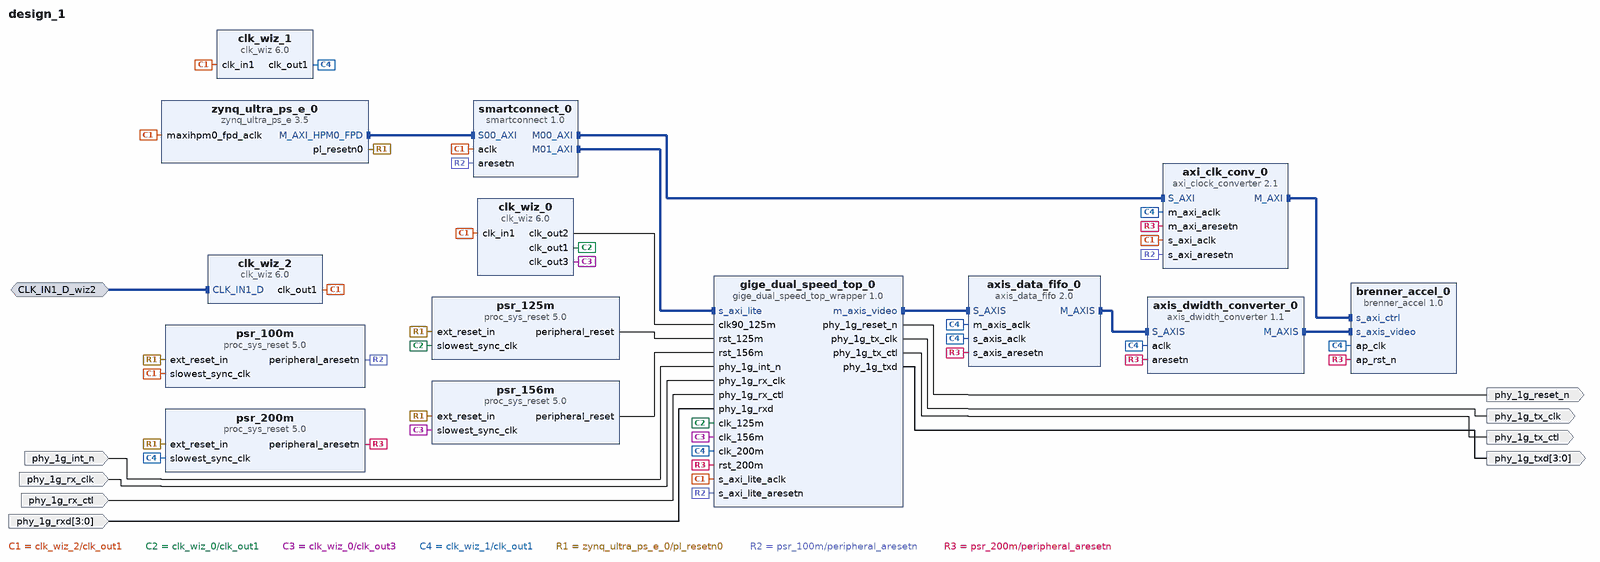
[diagram p0: block diagram of the top level]
# Vivado block design design_1, xczu3eg-sfvc784-1-i, Vivado 2024.2.2
create_bd_design design_1

create_bd_intf_port -mode Slave -vlnv xilinx.com:interface:diff_clock_rtl:1.0 CLK_IN1_D_wiz2
set_property -dict {CONFIG.FREQ_HZ 100000000} [get_bd_intf_ports CLK_IN1_D_wiz2]
create_bd_port -dir I phy_1g_rx_clk
create_bd_port -dir I -from 3 -to 0 phy_1g_rxd
create_bd_port -dir I phy_1g_rx_ctl
create_bd_port -dir O phy_1g_tx_clk
create_bd_port -dir O -from 3 -to 0 phy_1g_txd
create_bd_port -dir O phy_1g_tx_ctl
create_bd_port -dir O phy_1g_reset_n
create_bd_port -dir I phy_1g_int_n

create_bd_cell -type ip -vlnv xilinx.com:ip:zynq_ultra_ps_e:3.5 zynq_ultra_ps_e_0
set_property -dict [list \
  CONFIG.PSU__CRF_APB__DDR_CTRL__FREQMHZ 800 \
  CONFIG.PSU__DDRC__BUS_WIDTH {64 Bit} \
  CONFIG.PSU__DDRC__COMPONENTS Components \
  CONFIG.PSU__DDRC__DEVICE_CAPACITY {2048 MBits} \
  CONFIG.PSU__DDRC__DRAM_WIDTH {8 Bits} \
  CONFIG.PSU__DDRC__ECC Disabled \
  CONFIG.PSU__DDRC__MEMORY_TYPE {DDR 4} \
  CONFIG.PSU__DDRC__SPEED_BIN DDR4_1600J \
  CONFIG.PSU__DDR_HIGH_ADDRESS_GUI_ENABLE 0 \
  CONFIG.PSU__DDR__INTERFACE__FREQMHZ 400.000 \
  CONFIG.PSU__DEVICE_TYPE EG \
  CONFIG.PSU__FPGA_PL0_ENABLE 1 \
  CONFIG.PSU__MAXIGP0__DATA_WIDTH 128 \
  CONFIG.PSU__PSS_REF_CLK__FREQMHZ 33.333 \
  CONFIG.PSU__USE__IRQ0 0 \
  CONFIG.PSU__USE__M_AXI_GP0 1 \
  CONFIG.PSU__USE__M_AXI_GP1 0 \
  CONFIG.PSU__USE__M_AXI_GP2 0 \
] [get_bd_cells zynq_ultra_ps_e_0]
# 77 more settings of zynq_ultra_ps_e_0 are not shown: defaults, MIO pin electricals, DDR timing, and values the tool derives
create_bd_cell -type ip -vlnv xilinx.com:ip:clk_wiz:6.0 clk_wiz_0
set_property -dict [list \
  CONFIG.CLKOUT1_REQUESTED_DUTY_CYCLE 50.000 \
  CONFIG.CLKOUT1_REQUESTED_OUT_FREQ 125 \
  CONFIG.CLKOUT1_REQUESTED_PHASE 0.000 \
  CONFIG.CLKOUT1_USED true \
  CONFIG.CLKOUT2_REQUESTED_DUTY_CYCLE 50.000 \
  CONFIG.CLKOUT2_REQUESTED_OUT_FREQ 125 \
  CONFIG.CLKOUT2_REQUESTED_PHASE 90.000 \
  CONFIG.CLKOUT2_USED true \
  CONFIG.CLKOUT3_REQUESTED_DUTY_CYCLE 50.000 \
  CONFIG.CLKOUT3_REQUESTED_OUT_FREQ 156.25 \
  CONFIG.CLKOUT3_REQUESTED_PHASE 0.000 \
  CONFIG.CLKOUT3_USED true \
  CONFIG.CLKOUT4_USED false \
  CONFIG.CLKOUT5_USED false \
  CONFIG.CLKOUT6_USED false \
  CONFIG.CLKOUT7_USED false \
  CONFIG.MMCM_CLKFBOUT_MULT_F 12.500 \
  CONFIG.MMCM_CLKIN1_PERIOD 10.000 \
  CONFIG.MMCM_CLKOUT0_DIVIDE_F 10.000 \
  CONFIG.MMCM_CLKOUT0_DUTY_CYCLE 0.500 \
  CONFIG.MMCM_CLKOUT0_PHASE 0.000 \
  CONFIG.MMCM_CLKOUT1_DIVIDE 10 \
  CONFIG.MMCM_CLKOUT1_DUTY_CYCLE 0.500 \
  CONFIG.MMCM_CLKOUT1_PHASE 90.000 \
  CONFIG.MMCM_CLKOUT2_DIVIDE 8 \
  CONFIG.MMCM_CLKOUT2_DUTY_CYCLE 0.500 \
  CONFIG.MMCM_CLKOUT2_PHASE 0.000 \
  CONFIG.MMCM_COMPENSATION AUTO \
  CONFIG.MMCM_DIVCLK_DIVIDE 1 \
  CONFIG.NUM_OUT_CLKS 3 \
  CONFIG.PHASESHIFT_MODE WAVEFORM \
  CONFIG.PRIMITIVE MMCM \
  CONFIG.PRIM_IN_FREQ 100 \
  CONFIG.PRIM_SOURCE Single_ended_clock_capable_pin \
  CONFIG.RESET_TYPE ACTIVE_HIGH \
  CONFIG.USE_LOCKED true \
  CONFIG.USE_PHASE_ALIGNMENT true \
  CONFIG.USE_RESET false \
] [get_bd_cells clk_wiz_0]
create_bd_cell -type ip -vlnv xilinx.com:ip:clk_wiz:6.0 clk_wiz_1
set_property -dict [list \
  CONFIG.CLKOUT1_REQUESTED_DUTY_CYCLE 50.000 \
  CONFIG.CLKOUT1_REQUESTED_OUT_FREQ 200 \
  CONFIG.CLKOUT1_REQUESTED_PHASE 0.000 \
  CONFIG.CLKOUT1_USED true \
  CONFIG.CLKOUT2_USED false \
  CONFIG.CLKOUT3_USED false \
  CONFIG.CLKOUT4_USED false \
  CONFIG.CLKOUT5_USED false \
  CONFIG.CLKOUT6_USED false \
  CONFIG.CLKOUT7_USED false \
  CONFIG.MMCM_CLKFBOUT_MULT_F 12.000 \
  CONFIG.MMCM_CLKIN1_PERIOD 10.000 \
  CONFIG.MMCM_CLKOUT0_DIVIDE_F 6.000 \
  CONFIG.MMCM_CLKOUT0_DUTY_CYCLE 0.500 \
  CONFIG.MMCM_CLKOUT0_PHASE 0.000 \
  CONFIG.MMCM_COMPENSATION AUTO \
  CONFIG.MMCM_DIVCLK_DIVIDE 1 \
  CONFIG.NUM_OUT_CLKS 1 \
  CONFIG.PRIMITIVE MMCM \
  CONFIG.PRIM_IN_FREQ 100 \
  CONFIG.PRIM_SOURCE Single_ended_clock_capable_pin \
  CONFIG.RESET_TYPE ACTIVE_HIGH \
  CONFIG.USE_LOCKED true \
  CONFIG.USE_PHASE_ALIGNMENT false \
  CONFIG.USE_RESET false \
] [get_bd_cells clk_wiz_1]
create_bd_cell -type ip -vlnv xilinx.com:ip:clk_wiz:6.0 clk_wiz_2
set_property -dict [list \
  CONFIG.CLKOUT1_REQUESTED_DUTY_CYCLE 50.000 \
  CONFIG.CLKOUT1_REQUESTED_OUT_FREQ 100 \
  CONFIG.CLKOUT1_REQUESTED_PHASE 0.000 \
  CONFIG.CLKOUT1_USED true \
  CONFIG.CLKOUT2_USED false \
  CONFIG.CLKOUT3_USED false \
  CONFIG.CLKOUT4_USED false \
  CONFIG.CLKOUT5_USED false \
  CONFIG.CLKOUT6_USED false \
  CONFIG.CLKOUT7_USED false \
  CONFIG.MMCM_CLKFBOUT_MULT_F 12.000 \
  CONFIG.MMCM_CLKIN1_PERIOD 10.000 \
  CONFIG.MMCM_CLKOUT0_DIVIDE_F 12.000 \
  CONFIG.MMCM_CLKOUT0_DUTY_CYCLE 0.500 \
  CONFIG.MMCM_CLKOUT0_PHASE 0.000 \
  CONFIG.MMCM_COMPENSATION AUTO \
  CONFIG.MMCM_DIVCLK_DIVIDE 1 \
  CONFIG.NUM_OUT_CLKS 1 \
  CONFIG.PRIMITIVE MMCM \
  CONFIG.PRIM_IN_FREQ 100 \
  CONFIG.PRIM_SOURCE Differential_clock_capable_pin \
  CONFIG.RESET_TYPE ACTIVE_HIGH \
  CONFIG.USE_LOCKED true \
  CONFIG.USE_PHASE_ALIGNMENT false \
  CONFIG.USE_RESET false \
] [get_bd_cells clk_wiz_2]
create_bd_cell -type ip -vlnv xilinx.com:ip:proc_sys_reset:5.0 psr_100m
create_bd_cell -type ip -vlnv xilinx.com:ip:proc_sys_reset:5.0 psr_125m
create_bd_cell -type ip -vlnv xilinx.com:ip:proc_sys_reset:5.0 psr_156m
create_bd_cell -type ip -vlnv xilinx.com:ip:proc_sys_reset:5.0 psr_200m
create_bd_cell -type ip -vlnv xilinx.com:ip:smartconnect:1.0 smartconnect_0
set_property -dict {CONFIG.NUM_MI 2 CONFIG.NUM_SI 1} [get_bd_cells smartconnect_0]
create_bd_cell -type ip -vlnv xilinx.com:ip:axi_clock_converter:2.1 axi_clk_conv_0
set_property -dict {CONFIG.PROTOCOL AXI4LITE CONFIG.SYNCHRONIZATION_STAGES 3} [get_bd_cells axi_clk_conv_0]
create_bd_cell -type ip -vlnv xilinx.com:user:gige_dual_speed_top_wrapper:1.0 gige_dual_speed_top_0
set_property -dict [list \
  CONFIG.DEFAULT_CAM_PORT 0x2333 \
  CONFIG.DEFAULT_LOCAL_IP 0xC0A80180 \
  CONFIG.DEFAULT_LOCAL_MAC 0x0010A5010101 \
] [get_bd_cells gige_dual_speed_top_0]
create_bd_cell -type ip -vlnv xilinx.com:ip:axis_data_fifo:2.0 axis_data_fifo_0
set_property -dict [list \
  CONFIG.FIFO_DEPTH 512 \
  CONFIG.FIFO_MODE 1 \
  CONFIG.HAS_RD_DATA_COUNT 0 \
  CONFIG.HAS_TKEEP 0 \
  CONFIG.HAS_TLAST 1 \
  CONFIG.HAS_TSTRB 0 \
  CONFIG.HAS_WR_DATA_COUNT 0 \
  CONFIG.IS_ACLK_ASYNC 1 \
  CONFIG.SYNCHRONIZATION_STAGES 3 \
  CONFIG.TDATA_NUM_BYTES 8 \
  CONFIG.TUSER_WIDTH 1 \
] [get_bd_cells axis_data_fifo_0]
create_bd_cell -type ip -vlnv xilinx.com:ip:axis_dwidth_converter:1.1 axis_dwidth_converter_0
set_property -dict [list \
  CONFIG.HAS_MI_TKEEP 0 \
  CONFIG.HAS_TKEEP 0 \
  CONFIG.HAS_TLAST 1 \
  CONFIG.HAS_TSTRB 0 \
  CONFIG.M_TDATA_NUM_BYTES 1 \
  CONFIG.S_TDATA_NUM_BYTES 8 \
  CONFIG.TUSER_BITS_PER_BYTE 1 \
] [get_bd_cells axis_dwidth_converter_0]
create_bd_cell -type ip -vlnv xilinx.com:hls:brenner_accel:1.0 brenner_accel_0

# ---- connections ----

connect_bd_intf_net -intf_net CLK_IN1_D_wiz2_net [get_bd_intf_ports CLK_IN1_D_wiz2] [get_bd_intf_pins clk_wiz_2/CLK_IN1_D]
connect_bd_intf_net [get_bd_intf_pins axi_clk_conv_0/M_AXI] [get_bd_intf_pins brenner_accel_0/s_axi_ctrl]
connect_bd_intf_net [get_bd_intf_pins axis_dwidth_converter_0/M_AXIS] [get_bd_intf_pins brenner_accel_0/s_axis_video]
connect_bd_intf_net [get_bd_intf_pins axis_data_fifo_0/M_AXIS] [get_bd_intf_pins axis_dwidth_converter_0/S_AXIS]
connect_bd_intf_net [get_bd_intf_pins zynq_ultra_ps_e_0/M_AXI_HPM0_FPD] [get_bd_intf_pins smartconnect_0/S00_AXI]
connect_bd_intf_net [get_bd_intf_pins smartconnect_0/M00_AXI] [get_bd_intf_pins axi_clk_conv_0/S_AXI]
connect_bd_intf_net [get_bd_intf_pins smartconnect_0/M01_AXI] [get_bd_intf_pins gige_dual_speed_top_0/s_axi_lite]
connect_bd_intf_net [get_bd_intf_pins gige_dual_speed_top_0/m_axis_video] [get_bd_intf_pins axis_data_fifo_0/S_AXIS]
connect_bd_net -net clk_ctrl_100m [get_bd_pins clk_wiz_2/clk_out1] \
  [get_bd_pins zynq_ultra_ps_e_0/maxihpm0_fpd_aclk] [get_bd_pins smartconnect_0/aclk] [get_bd_pins axi_clk_conv_0/s_axi_aclk] \
  [get_bd_pins psr_100m/slowest_sync_clk] [get_bd_pins clk_wiz_1/clk_in1] [get_bd_pins clk_wiz_0/clk_in1] \
  [get_bd_pins gige_dual_speed_top_0/s_axi_lite_aclk]
connect_bd_net -net clk_data_125m [get_bd_pins clk_wiz_0/clk_out1] \
  [get_bd_pins psr_125m/slowest_sync_clk] [get_bd_pins gige_dual_speed_top_0/clk_125m]
connect_bd_net -net clk_data_125m_90 [get_bd_pins clk_wiz_0/clk_out2] [get_bd_pins gige_dual_speed_top_0/clk90_125m]
connect_bd_net -net clk_data_156m [get_bd_pins clk_wiz_0/clk_out3] \
  [get_bd_pins psr_156m/slowest_sync_clk] [get_bd_pins gige_dual_speed_top_0/clk_156m]
connect_bd_net -net clk_data_200m [get_bd_pins clk_wiz_1/clk_out1] \
  [get_bd_pins axis_data_fifo_0/s_axis_aclk] [get_bd_pins axis_data_fifo_0/m_axis_aclk] \
  [get_bd_pins axis_dwidth_converter_0/aclk] [get_bd_pins brenner_accel_0/ap_clk] [get_bd_pins axi_clk_conv_0/m_axi_aclk] \
  [get_bd_pins psr_200m/slowest_sync_clk] [get_bd_pins gige_dual_speed_top_0/clk_200m]
connect_bd_net [get_bd_pins gige_dual_speed_top_0/phy_1g_reset_n] [get_bd_ports phy_1g_reset_n]
connect_bd_net [get_bd_pins gige_dual_speed_top_0/phy_1g_tx_clk] [get_bd_ports phy_1g_tx_clk]
connect_bd_net [get_bd_pins gige_dual_speed_top_0/phy_1g_tx_ctl] [get_bd_ports phy_1g_tx_ctl]
connect_bd_net [get_bd_pins gige_dual_speed_top_0/phy_1g_txd] [get_bd_ports phy_1g_txd]
connect_bd_net [get_bd_ports phy_1g_int_n] [get_bd_pins gige_dual_speed_top_0/phy_1g_int_n]
connect_bd_net [get_bd_ports phy_1g_rx_clk] [get_bd_pins gige_dual_speed_top_0/phy_1g_rx_clk]
connect_bd_net [get_bd_ports phy_1g_rx_ctl] [get_bd_pins gige_dual_speed_top_0/phy_1g_rx_ctl]
connect_bd_net [get_bd_ports phy_1g_rxd] [get_bd_pins gige_dual_speed_top_0/phy_1g_rxd]
connect_bd_net -net ps_pl_resetn0 [get_bd_pins zynq_ultra_ps_e_0/pl_resetn0] \
  [get_bd_pins psr_100m/ext_reset_in] [get_bd_pins psr_125m/ext_reset_in] [get_bd_pins psr_156m/ext_reset_in] \
  [get_bd_pins psr_200m/ext_reset_in]
connect_bd_net -net rst_ctrl_100m [get_bd_pins psr_100m/peripheral_aresetn] \
  [get_bd_pins smartconnect_0/aresetn] [get_bd_pins axi_clk_conv_0/s_axi_aresetn] \
  [get_bd_pins gige_dual_speed_top_0/s_axi_lite_aresetn]
connect_bd_net -net rst_data_125m [get_bd_pins psr_125m/peripheral_reset] [get_bd_pins gige_dual_speed_top_0/rst_125m]
connect_bd_net -net rst_data_156m [get_bd_pins psr_156m/peripheral_reset] [get_bd_pins gige_dual_speed_top_0/rst_156m]
connect_bd_net -net rst_data_200m [get_bd_pins psr_200m/peripheral_aresetn] \
  [get_bd_pins axis_data_fifo_0/s_axis_aresetn] [get_bd_pins axis_dwidth_converter_0/aresetn] \
  [get_bd_pins brenner_accel_0/ap_rst_n] [get_bd_pins axi_clk_conv_0/m_axi_aresetn] \
  [get_bd_pins gige_dual_speed_top_0/rst_200m]

# ---- address map ----
assign_bd_address -offset 0x00A0000000 -range 64K -target_address_space [get_bd_addr_spaces zynq_ultra_ps_e_0/Data] [get_bd_addr_segs brenner_accel_0/s_axi_ctrl/Reg]
assign_bd_address -offset 0x00A0010000 -range 4K -target_address_space [get_bd_addr_spaces zynq_ultra_ps_e_0/Data] [get_bd_addr_segs gige_dual_speed_top_0/s_axi_lite/reg0]

validate_bd_design
save_bd_design
